# Altium schematic sheet 20_STEP_MOTOR_DRIVER_2.SchDoc
size 420 x 297 mm; SheetNumber: 24; SheetTotal: 27
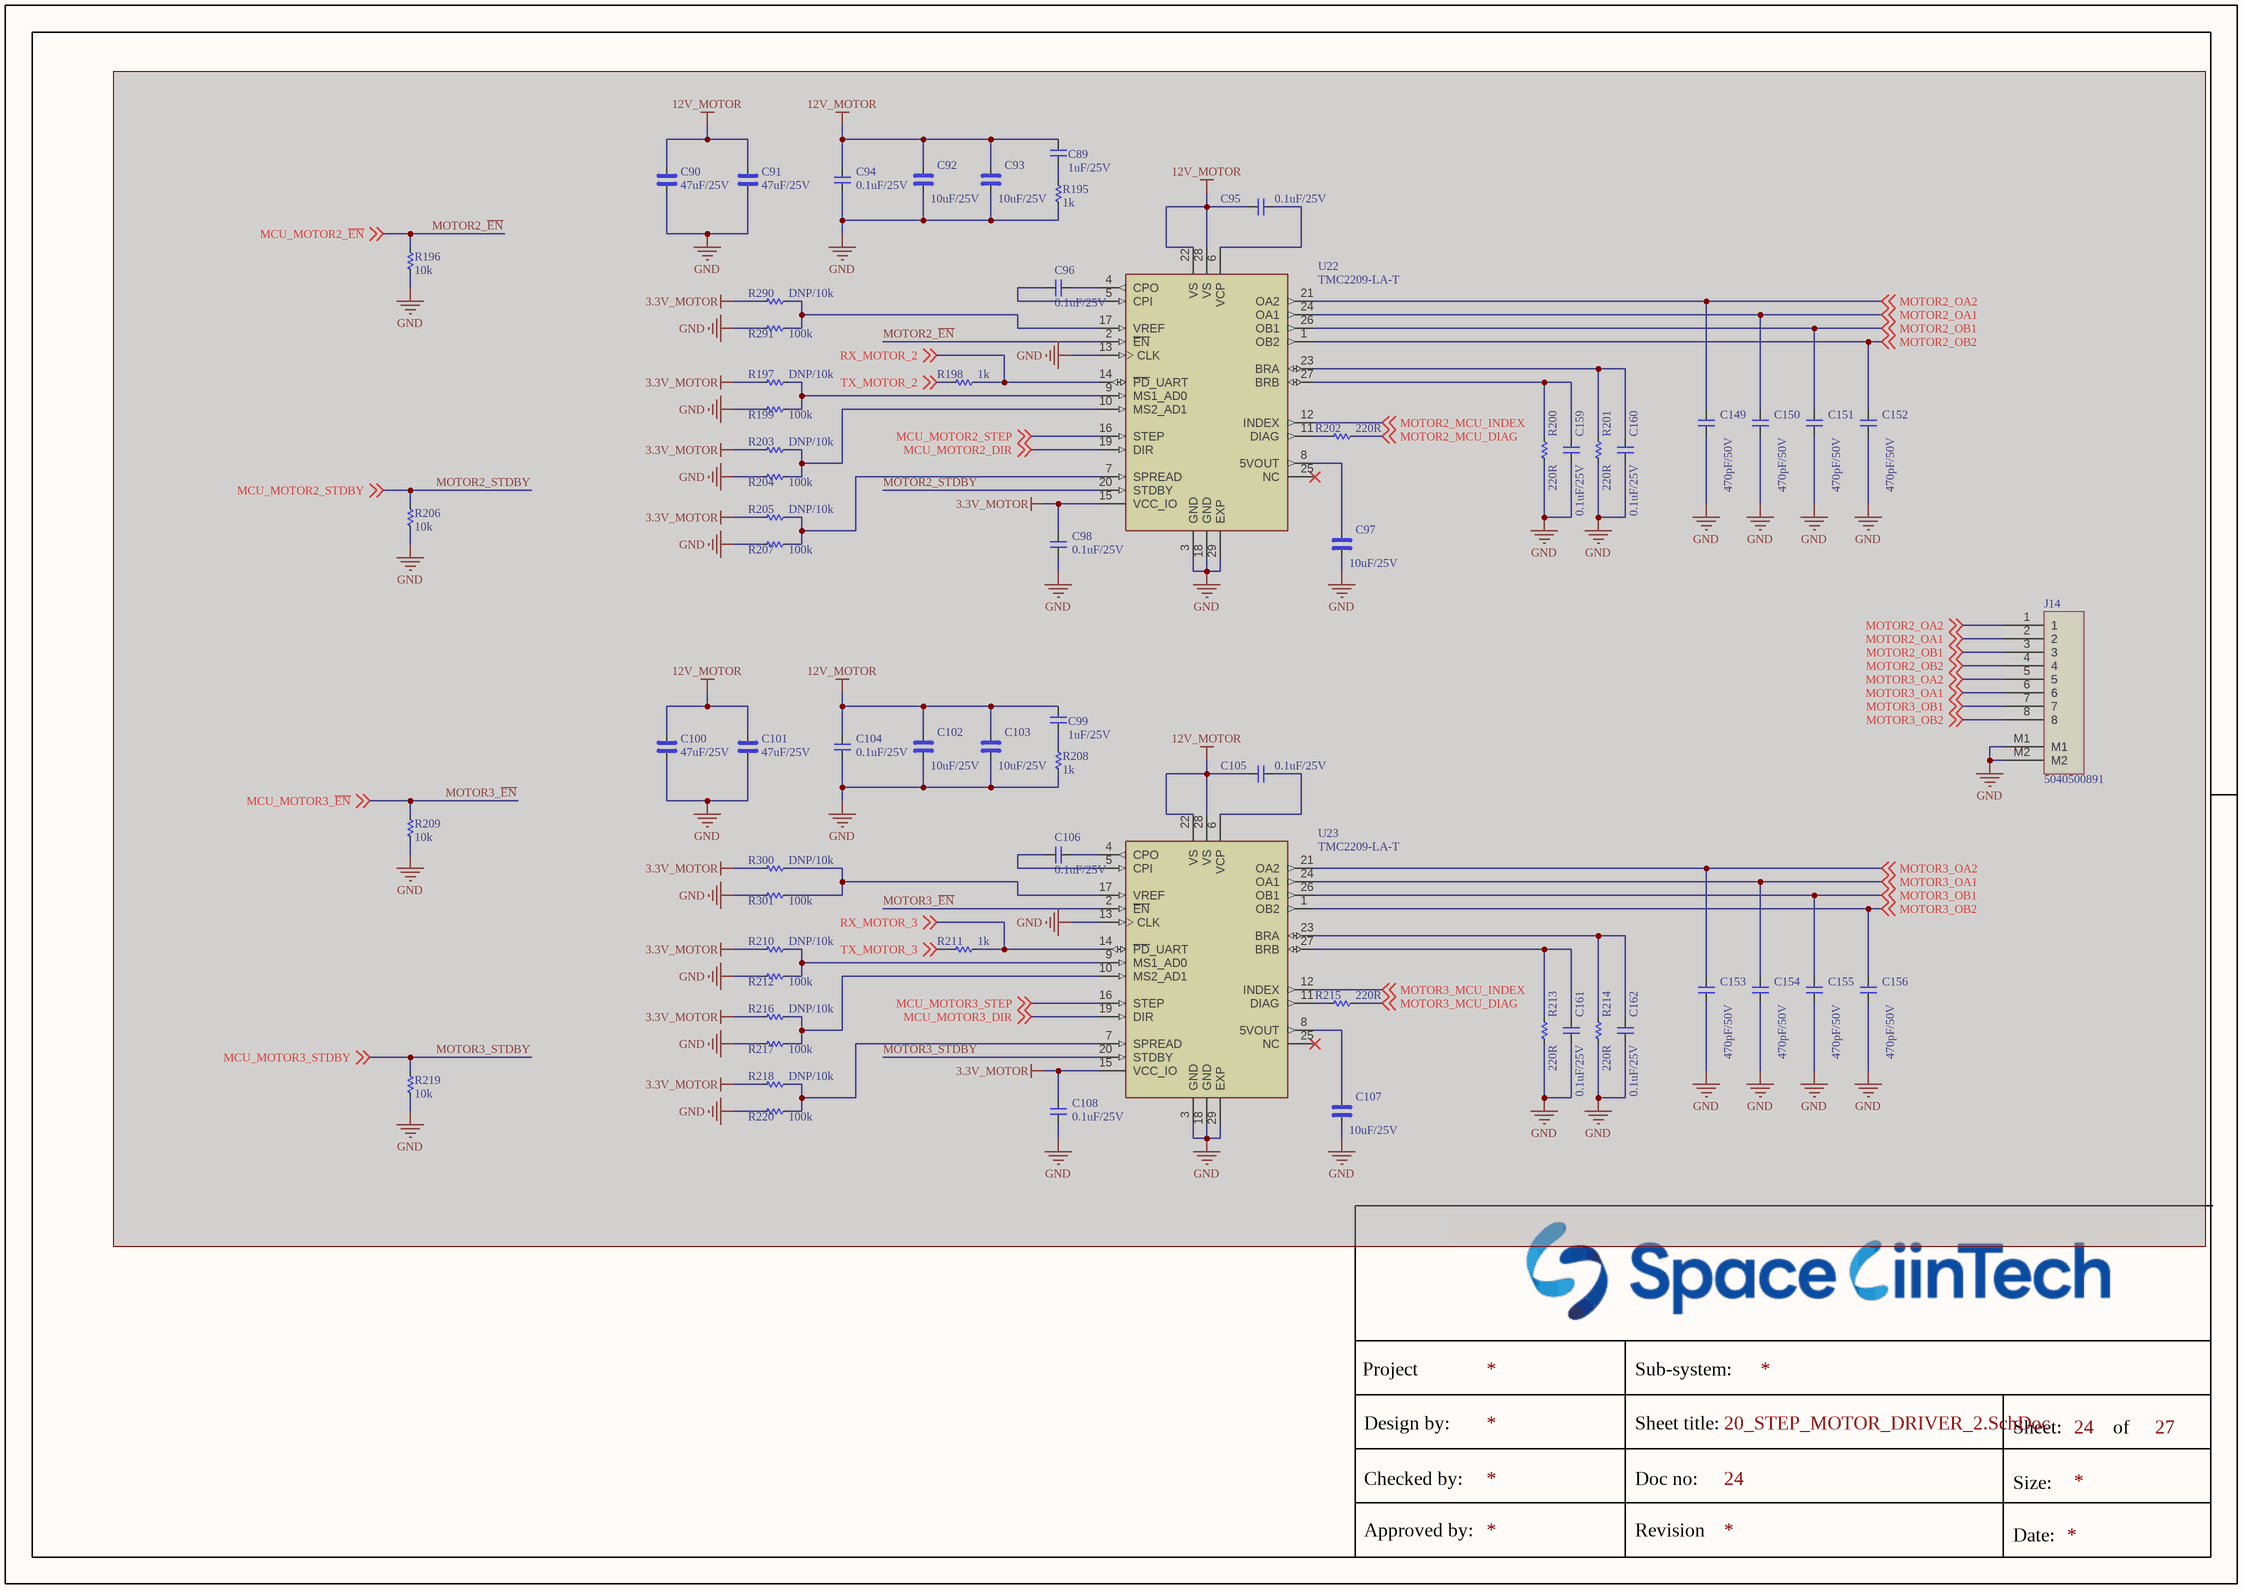
[diagram p0: 20_STEP_MOTOR_DRIVER_2.SchDoc]

## Parts
C89  1uF/25V  [CAP_C_1005X60]  (masked out: inside a compile mask, not in the netlist)
C90  47uF/25V  [CAP_C_3225X80]  (masked out: inside a compile mask, not in the netlist)
C91  47uF/25V  [CAP_C_3225X80]  (masked out: inside a compile mask, not in the netlist)
C92  10uF/25V  [CAP_C_2012X110]  (masked out: inside a compile mask, not in the netlist)
C93  10uF/25V  [CAP_C_2012X110]  (masked out: inside a compile mask, not in the netlist)
C94  0.1uF/25V  [CAP_C_1005X60]  (masked out: inside a compile mask, not in the netlist)
C95  0.1uF/25V  [CAP_C_1005X60]  (masked out: inside a compile mask, not in the netlist)
C96  0.1uF/25V  [CAP_C_1005X60]  (masked out: inside a compile mask, not in the netlist)
C97  10uF/25V  [CAP_C_2012X110]  (masked out: inside a compile mask, not in the netlist)
C98  0.1uF/25V  [CAP_C_1005X60]  (masked out: inside a compile mask, not in the netlist)
C99  1uF/25V  [CAP_C_1005X60]  (masked out: inside a compile mask, not in the netlist)
C100  47uF/25V  [CAP_C_3225X80]  (masked out: inside a compile mask, not in the netlist)
C101  47uF/25V  [CAP_C_3225X80]  (masked out: inside a compile mask, not in the netlist)
C102  10uF/25V  [CAP_C_2012X110]  (masked out: inside a compile mask, not in the netlist)
C103  10uF/25V  [CAP_C_2012X110]  (masked out: inside a compile mask, not in the netlist)
C104  0.1uF/25V  [CAP_C_1005X60]  (masked out: inside a compile mask, not in the netlist)
C105  0.1uF/25V  [CAP_C_1005X60]  (masked out: inside a compile mask, not in the netlist)
C106  0.1uF/25V  [CAP_C_1005X60]  (masked out: inside a compile mask, not in the netlist)
C107  10uF/25V  [CAP_C_2012X110]  (masked out: inside a compile mask, not in the netlist)
C108  0.1uF/25V  [CAP_C_1005X60]  (masked out: inside a compile mask, not in the netlist)
C149  470pF/50V  [CAP_C_1608X80]  (masked out: inside a compile mask, not in the netlist)
C150  470pF/50V  [CAP_C_1608X80]  (masked out: inside a compile mask, not in the netlist)
C151  470pF/50V  [CAP_C_1608X80]  (masked out: inside a compile mask, not in the netlist)
C152  470pF/50V  [CAP_C_1608X80]  (masked out: inside a compile mask, not in the netlist)
C153  470pF/50V  [CAP_C_1608X80]  (masked out: inside a compile mask, not in the netlist)
C154  470pF/50V  [CAP_C_1608X80]  (masked out: inside a compile mask, not in the netlist)
C155  470pF/50V  [CAP_C_1608X80]  (masked out: inside a compile mask, not in the netlist)
C156  470pF/50V  [CAP_C_1608X80]  (masked out: inside a compile mask, not in the netlist)
C159  0.1uF/25V  [CAP_C_1608X80]  (masked out: inside a compile mask, not in the netlist)
C160  0.1uF/25V  [CAP_C_1608X80]  (masked out: inside a compile mask, not in the netlist)
C161  0.1uF/25V  [CAP_C_1608X80]  (masked out: inside a compile mask, not in the netlist)
C162  0.1uF/25V  [CAP_C_1608X80]  (masked out: inside a compile mask, not in the netlist)
J14  5040500891  [MOLEX_5040500891]  (masked out: inside a compile mask, not in the netlist)
R195  1k  [RES_C_1005X40]  (masked out: inside a compile mask, not in the netlist)
R196  10k  [RES_C_1005X40]  (masked out: inside a compile mask, not in the netlist)
R197  DNP/10k  [RES_C_1005X40]  (masked out: inside a compile mask, not in the netlist)
R198  1k  [RES_C_1005X40]  (masked out: inside a compile mask, not in the netlist)
R199  100k  [RES_C_1005X40]  (masked out: inside a compile mask, not in the netlist)
R200  220R  [RES_C_1005X40]  (masked out: inside a compile mask, not in the netlist)
R201  220R  [RES_C_1005X40]  (masked out: inside a compile mask, not in the netlist)
R202  220R  [RES_C_1005X40]  (masked out: inside a compile mask, not in the netlist)
R203  DNP/10k  [RES_C_1005X40]  (masked out: inside a compile mask, not in the netlist)
R204  100k  [RES_C_1005X40]  (masked out: inside a compile mask, not in the netlist)
R205  DNP/10k  [RES_C_1005X40]  (masked out: inside a compile mask, not in the netlist)
R206  10k  [RES_C_1005X40]  (masked out: inside a compile mask, not in the netlist)
R207  100k  [RES_C_1005X40]  (masked out: inside a compile mask, not in the netlist)
R208  1k  [RES_C_1005X40]  (masked out: inside a compile mask, not in the netlist)
R209  10k  [RES_C_1005X40]  (masked out: inside a compile mask, not in the netlist)
R210  DNP/10k  [RES_C_1005X40]  (masked out: inside a compile mask, not in the netlist)
R211  1k  [RES_C_1005X40]  (masked out: inside a compile mask, not in the netlist)
R212  100k  [RES_C_1005X40]  (masked out: inside a compile mask, not in the netlist)
R213  220R  [RES_C_1005X40]  (masked out: inside a compile mask, not in the netlist)
R214  220R  [RES_C_1005X40]  (masked out: inside a compile mask, not in the netlist)
R215  220R  [RES_C_1005X40]  (masked out: inside a compile mask, not in the netlist)
R216  DNP/10k  [RES_C_1005X40]  (masked out: inside a compile mask, not in the netlist)
R217  100k  [RES_C_1005X40]  (masked out: inside a compile mask, not in the netlist)
R218  DNP/10k  [RES_C_1005X40]  (masked out: inside a compile mask, not in the netlist)
R219  10k  [RES_C_1005X40]  (masked out: inside a compile mask, not in the netlist)
R220  100k  [RES_C_1005X40]  (masked out: inside a compile mask, not in the netlist)
R290  DNP/10k  [RES_C_1005X40]  (masked out: inside a compile mask, not in the netlist)
R291  100k  [RES_C_1005X40]  (masked out: inside a compile mask, not in the netlist)
R300  DNP/10k  [RES_C_1005X40]  (masked out: inside a compile mask, not in the netlist)
R301  100k  [RES_C_1005X40]  (masked out: inside a compile mask, not in the netlist)
U22  TMC2209-LA-T  [QFN50P500X500X90-29N]  (masked out: inside a compile mask, not in the netlist)
U23  TMC2209-LA-T  [QFN50P500X500X90-29N]  (masked out: inside a compile mask, not in the netlist)

## Notes on the sheet
- Project
- Sub-system:
- Design by:
- Sheet title:
- Sheet:
- of
- Checked by:
- Approved by:
- Doc no:
- Revision
- Size:
- Date:

## Library data of the parts
C89 C94-C96 C98 C99 C104-C106 C108 C149-C156 C159-C162 = _CAP_C_2: CAP
C90-C93 C97 C100-C103 C107 = _CAP_C_High_2: CAP High Value
J14 = Header 8x1_2M
R195-R220 R290 R291 R300 R301 = _RES_B_2: RES
U22 U23 = TMC2209-LA-T: Bipolar Motor Driver Power MOSFET Step/Direction, UART 28-QFN (5x5); MF: Trinamic Motion Control GmbH; SnapEDA_Link: https://www.snapeda.com/parts/TMC2209-LA-T/Trinamic/view-part/?ref=snap; Package: VFQFN-28 Trinamic; Value: *; MP: TMC2209-LA-T; Check_prices: https://www.snapeda.com/parts/TMC2209-LA-T/Trinamic/view-part/?ref=eda